# Altium project ADA_SYSTEM_TFG.PrjPcb
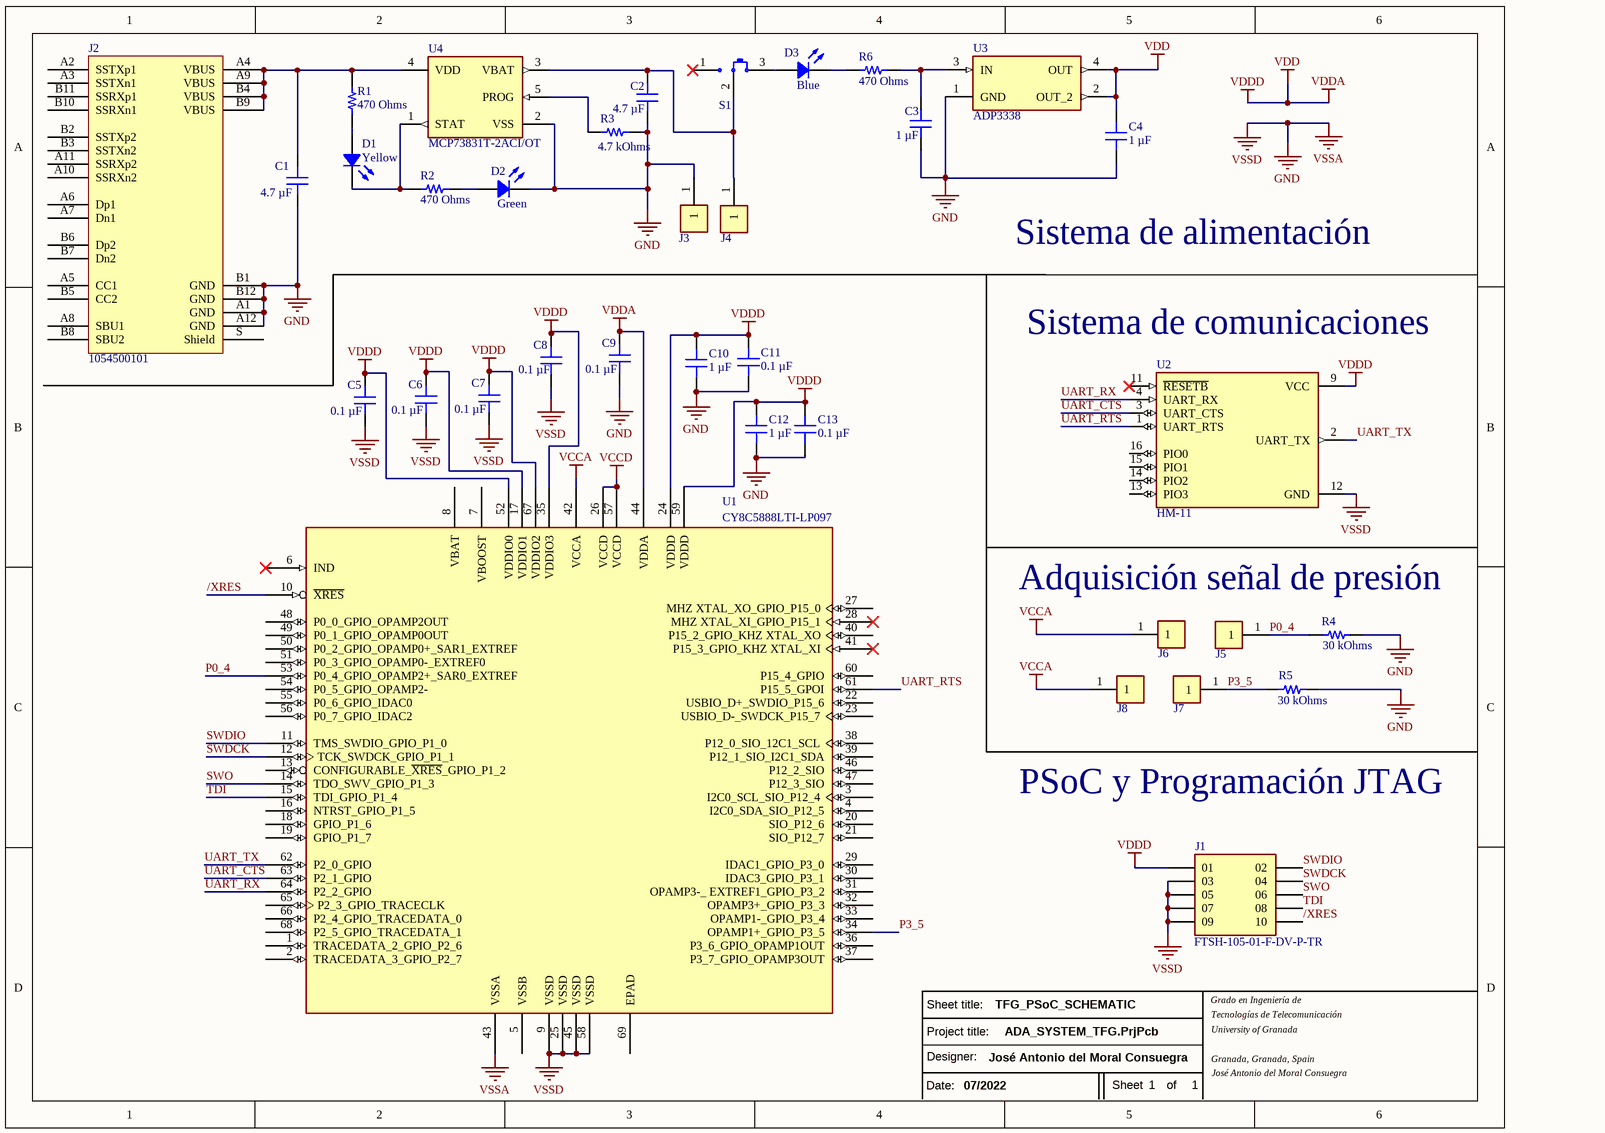
[diagram p0: TFG_PSoC_SCHEMATIC.SchDoc]
1 sheet, 35 parts. Net scope: global (net labels, ports and power ports of the same name join across sheets).
Board file: TFG_PSoC_PCB.PcbDoc

## Sheet TFG_PSoC_SCHEMATIC.SchDoc
size 282 x 211 mm; SheetNumber: 1; SheetTotal: 1

### Parts
C1  4.7 µF  [CAP 0805_2012]
C2  4.7 µF  [CAP 0805_2012]
C3  1 µF  [CAP 0603_1608]
C4  1 µF  [CAP 0603_1608]
C5  0.1 µF  [CAP 0603_1608]
C6  0.1 µF  [CAP 0603_1608]
C7  0.1 µF  [CAP 0603_1608]
C8  0.1 µF  [CAP 0603_1608]
C9  0.1 µF  [CAP 0603_1608]
C10  1 µF  [CAP 0603_1608]
C11  0.1 µF  [CAP 0603_1608]
C12  1 µF  [CAP 0603_1608]
C13  0.1 µF  [CAP 0603_1608]
D1  Yellow  [LED 1206_3216 YELLOW]
D2  Green  [LED 1206_3216 GREEN]
D3  Blue  [LED 1206_3216 BLUE]
J1  FTSH-105-01-F-DV-P-TR  [SAMTEC_FTSH-105-01-F-DV-P-TR]
J2  1054500101  [Molex 1054500101]
J3  103321-1  [TE_103321-1]  (value not drawn)
J4  103321-1  [TE_103321-1]  (value not drawn)
J5  103321-1  [TE_103321-1]  (value not drawn)
J6  103321-1  [TE_103321-1]  (value not drawn)
J7  103321-1  [TE_103321-1]  (value not drawn)
J8  103321-1  [TE_103321-1]  (value not drawn)
R1  470 Ohms  [RES 0603_1608]
R2  470 Ohms  [RES 0603_1608]
R3  4.7 kOhms  [RES 0603_1608]
R4  30 kOhms  [RES 0603_1608]
R5  30 kOhms  [RES 0603_1608]
R6  470 Ohms  [RES 0603_1608]
S1  SS312SAH4-R  [NKK SS312SAH4]  (value not drawn)
U1  CY8C5888LTI-LP097  [QFN-68]
U2  HM-11  [XCVR_317030001]
U3  ADP3338  [SOT230P700X180-4N]
U4  MCP73831T-2ACI/OT  [SOT95P280X145-5N]

### Nets
GND: C1.1 C2.2 C3.1 C4.1 C5.1 C6.1 C7.1 C8.1 C9.1 C10.1 C11.1 C12.1 C13.1 D2.2 J1.03 J1.05 J1.07 J1.09 J2.A1(GND) J2.A12(GND) J2.B1(GND) J2.B12(GND) J3.1 R3.2 R4.1 R5.1 U1.9(VSSD) U1.25(VSSD) U1.43(VSSA) U1.45(VSSD) U1.58(VSSD) U2.12(GND) U3.1(GND) U4.2(VSS)  [also labelled VSSA, VSSD]
VCCA: J6.1 J8.1 U1.42(VCCA)
VCCD: U1.26(VCCD) U1.57(VCCD)
VDD: C4.2 C5.2 C6.2 C7.2 C8.2 C9.2 C10.2 C11.2 C12.2 C13.2 J1.01 U1.17(VDDIO1) U1.24(VDDD) U1.35(VDDIO3) U1.44(VDDA) U1.52(VDDIO0) U1.59(VDDD) U1.67(VDDIO2) U2.9(VCC) U3.2(OUT_2) U3.4(OUT)  [also labelled VDDA, VDDD]
/XRES: J1.10 U1.10(~{XRES})
P0_4: J5.1 R4.2 U1.53(P0_4_GPIO_OPAMP2+_SAR0_EXTREF)
P3_5: J7.1 R5.2 U1.34(OPAMP1+_GPIO_P3_5)
SWDCK: J1.04 U1.12(TCK_SWDCK_GPIO_P1_1)
SWDIO: J1.02 U1.11(TMS_SWDIO_GPIO_P1_0)
SWO: J1.06 U1.14(TDO_SWV_GPIO_P1_3)
TDI: J1.08 U1.15(TDI_GPIO_P1_4)
UART_CTS: U1.63(P2_1_GPIO) U2.3(UART_CTS)
UART_RTS: U1.61(P15_5_GPOI) U2.1(UART_RTS)
UART_RX: U1.64(P2_2_GPIO) U2.4(UART_RX)
UART_TX: U1.62(P2_0_GPIO) U2.2(UART_TX)
NetC1_2: C1.2 J2.A4(VBUS) J2.A9(VBUS) J2.B4(VBUS) J2.B9(VBUS) R1.2 U4.4(VDD)
NetC2_1: C2.1 J4.1 S1.2(COM) U4.3(VBAT)
NetC3_2: C3.2 R6.1 U3.3(IN)
NetD1_1: D1.1 R1.1
NetD1_2: D1.2 R2.2 U4.1(STAT)
NetD2_1: D2.1 R2.1
NetD3_1: D3.1 S1.3
NetD3_2: D3.2 R6.2
NetR3_1: R3.1 U4.5(PROG)

Not connected (* = marked no-connect by the designer): J2 A2(SSTXp1) A3(SSTXn1) A5(CC1) A6(Dp1) A7(Dn1) A8(SBU1) A10(SSRXn2) A11(SSRXp2) B2(SSTXp2) B3(SSTXn2) B5(CC2) B6(Dp2) B7(Dn2) B8(SBU2) B10(SSRXn1) B11(SSRXp1) S(Shield); S1 1*; U1 1(TRACEDATA_2_GPIO_P2_6) 2(TRACEDATA_3_GPIO_P2_7) 3(I2C0_SCL_SIO_P12_4) 4(I2C0_SDA_SIO_P12_5) 5(VSSB) 6(IND)* 7(VBOOST) 8(VBAT) 13(CONFIGURABLE_~{XRES}_GPIO_P1_2) 16(NTRST_GPIO_P1_5) 18(GPIO_P1_6) 19(GPIO_P1_7) 20(SIO_P12_6) 21(SIO_P12_7) 22(USBIO_D+_SWDIO_P15_6) 23(USBIO_D-_SWDCK_P15_7) 27(MHZ_XTAL_XO_GPIO_P15_0) 28(MHZ_XTAL_XI_GPIO_P15_1)* 29(IDAC1_GPIO_P3_0) 30(IDAC3_GPIO_P3_1) 31(OPAMP3-__EXTREF1_GPIO_P3_2) 32(OPAMP3+_GPIO_P3_3) 33(OPAMP1-_GPIO_P3_4) 36(P3_6_GPIO_OPAMP1OUT) 37(P3_7_GPIO_OPAMP3OUT) 38(P12_0_SIO_12C1_SCL) 39(P12_1_SIO_I2C1_SDA) 40(P15_2_GPIO_KHZ_XTAL_XO) 41(P15_3_GPIO_KHZ_XTAL_XI)* 46(P12_2_SIO) 47(P12_3_SIO) 48(P0_0_GPIO_OPAMP2OUT) 49(P0_1_GPIO_OPAMP0OUT) 50(P0_2_GPIO_OPAMP0+_SAR1_EXTREF) 51(P0_3_GPIO_OPAMP0-_EXTREF0) 54(P0_5_GPIO_OPAMP2-) 55(P0_6_GPIO_IDAC0) 56(P0_7_GPIO_IDAC2) 60(P15_4_GPIO) 65(P2_3_GPIO_TRACECLK) 66(P2_4_GPIO_TRACEDATA_0) 68(P2_5_GPIO_TRACEDATA_1) 69(EPAD); U2 11(~{RESETB})* 13(PIO3) 14(PIO2) 15(PIO1) 16(PIO0)

### Notes on the sheet
- Sistema de alimentación
- (near U2) Sistema de comunicaciones
- Adquisición señal de presión
- PSoC y Programación JTAG
- Sheet title:
- TFG_PSoC_SCHEMATIC
- Grado en Ingeniería de
- Tecnologías de Telecomunicación
- Date:
- Project title:
- Designer:
- 07/2022
- José Antonio del Moral Consuegra
- Sheet
- 1
- of
- University of Granada
- Granada, Granada, Spain

### Library data of the parts
C1 C2 = CL21B475KOFNFNE: CAP CER 4.7UF 16V X7R 0805; manufacturer: Samsung Electro-Mechanics; Tolerance: ±10%; Part Number: CL21B475KOFNFNE; Value: 4.7 µF; Applications: General Purpose; Capacitance: 4.7 µF; componentlink1description: Datasheet; componentlink1url: http://www.samsungsem.com/kr/support/product-search/mlcc/CL21B475KOFNFNE.jsp; componentlink2description: DigiKey Link; componentlink2url: https://www.digikey.com/en/products/detail/samsung-electro-mechanics/CL21B475KOFNFNE/3888628; Device Package: 0805 (2012 Metric); lastupdated: 27/06/2022 11:05:52; Lifecycle Status: Active; Minimum Order: 1; Mounting Type: Surface Mount, MLCC; Operating Temperature: -55°C ~ 125°C; Package / Case: 0805 (2012 Metric); packaging: TapeAndReel; partid: 4760; Part Status: Active; price: 0.03; series: CL; Size / Dimension: 0.079" L x 0.049" W (2.00mm x 1.25mm); Supplier 1: DigiKey; Supplier Part Number 1: 1276-2970-1-ND; Temperature Coefficient: X7R; Thickness (Max): 0.053" (1.35mm); Voltage - Rated: 16V
C3 C4 C10 C12 = C0603X105M4RACAUTO: CAP CER 1UF 16V X7R 0603; manufacturer: KEMET; Tolerance: ±20%; Part Number: C0603X105M4RACAUTO; Value: 1 µF; Applications: Automotive, Boardflex Sensitive; Capacitance: 1 µF; componentlink1description: Datasheet; componentlink1url: https://api.kemet.com/component-edge/download/datasheet/C0603X105M4RACAUTO.pdf; componentlink2description: DigiKey Link; componentlink2url: https://www.digikey.com/en/products/detail/kemet/C0603X105M4RACAUTO/8635846; Device Package: 0603 (1608 Metric); Features: Soft Termination; lastupdated: 27/06/2022 11:02:50; Lifecycle Status: Active; Minimum Order: 1; Mounting Type: Surface Mount, MLCC; Operating Temperature: -55°C ~ 125°C; Package / Case: 0603 (1608 Metric); packaging: CutTape; partid: 3927; Part Status: Active; price: 0.09; Ratings: AEC-Q200; series: SMD Auto X7R Flex; Size / Dimension: 0.063" L x 0.031" W (1.60mm x 0.80mm); Supplier 1: DigiKey; Supplier Part Number 1: 399-17719-2-ND; Temperature Coefficient: X7R; Thickness (Max): 0.037" (0.95mm); Voltage - Rated: 16V
C5-C9 C11 C13 = CS0603KRX7R7BB104: CAP CER 0.1UF 16V X7R 0603; manufacturer: Yageo; Tolerance: ±10%; Part Number: CS0603KRX7R7BB104; Value: 0.1 µF; Applications: Boardflex Sensitive; Capacitance: 0.1 µF; componentlink1description: Datasheet; componentlink1url: http://www.yageo.com/NewPortal/yageodocoutput?fileName=/pdf/MLCC/UPY-ST_NPOX7R_16V-to-3KV_5.pdf; componentlink2description: DigiKey Link; componentlink2url: https://www.digikey.com/en/products/detail/yageo/CS0603KRX7R7BB104/6097897; Device Package: 0603 (1608 Metric); Features: Soft Termination; lastupdated: 27/06/2022 11:02:54; Lifecycle Status: Active; Minimum Order: 1; Mounting Type: Surface Mount, MLCC; Operating Temperature: -55°C ~ 125°C; Package / Case: 0603 (1608 Metric); packaging: TapeAndReel; partid: 2286; Part Status: Active; price: 0.02; series: CS; Size / Dimension: 0.063" L x 0.031" W (1.60mm x 0.80mm); Supplier 1: DigiKey; Supplier Part Number 1: 311-3560-1-ND; Temperature Coefficient: X7R; Thickness (Max): 0.037" (0.95mm); Voltage - Rated: 16V
D1 = 5990240007F: LED YELLOW 1206 SMD; Manufacturer: Dialight; Configuration: Standard; Current - Test: 20mA; Lens Color: 0.80mm; Lens Size: 2.00mm x 1.60mm; Lens Style: Rectangle with Flat Top; Millicandela Rating: 126mcd; Viewing Angle: 140°; Voltage - Forward (Vf) (Typ): 2.1V; Wavelength - Dominant: 590nm; Part Number: 5990240007F; Color: Yellow; ComponentLink1Description: Datasheet; ComponentLink1URL: http://www.dialightsignalsandcomponents.com/Assets/Brochures_And_Catalogs/Indication/CBI_SMD_new/Dialight_CBI_data_599-1206_Apr2018.pdf; ComponentLink2Description: DigiKey Link; ComponentLink2URL: https://www.digikey.com/en/products/detail/dialight/5990240007F/9385418; Device Package: 1206 (3216 Metric); Height (Max): 0.80mm; LastUpdated: 27/06/2022 11:49:43; Lifecycle Status: Active; Minimum Order: 1; Mounting Type: Surface Mount; Package / Case: 1206 (3216 Metric); Packaging: TapeAndReel; PartId: 1; Part Status: Active; Price: 0.04; Series: 599; Size / Dimension: 3.20mm L x 1.60mm W; Supplier 1: DigiKey; Supplier Part Number 1: 350-4363-1-ND; Supplier Device Package: 1206; Value: Yellow
D2 = SM1206GC-IL: LED GREEN CLEAR 1206 SMD; Manufacturer: Bivar Inc.; Configuration: Standard; Current - Test: 20mA; Lens Color: Colorless; Lens Size: 1.10mm Dia; Lens Style: Round with Flat Top; Millicandela Rating: 40mcd; Viewing Angle: 30°; Voltage - Forward (Vf) (Typ): 2V; Wavelength - Dominant: 570nm; Wavelength - Peak: 568nm; Part Number: SM1206GC-IL; Color: Green; ComponentLink1Description: Datasheet; ComponentLink1URL: https://www.bivar.com/Files/Datasheets/SM1206GC-IL.pdf; ComponentLink2Description: DigiKey Link; ComponentLink2URL: https://www.digikey.com/en/products/detail/bivar-inc/SM1206GC-IL/3095544; Device Package: 1206 (3216 Metric); Height (Max): 1.40mm; LastUpdated: 27/06/2022 11:49:06; Lens Transparency: Clear; Lifecycle Status: Active; Minimum Order: 1; Mounting Type: Surface Mount; Package / Case: 1206 (3216 Metric); Packaging: TapeAndReel; PartId: 536; Part Status: Active; Price: 0.24; Series: -; Size / Dimension: 3.20mm L x 1.60mm W; Supplier 1: DigiKey; Supplier Part Number 1: 492-1697-1-ND; Supplier Device Package: 1206; Value: Green
D3 = 5990291007F: LED BLUE 1206 SMD; Part Number: 5990291007F
J1 = FTSH-105-01-F-DV-P-TR: MF: Samtec; Package: None; Price: None; Value: *; MP: FTSH-105-01-F-DV-P-TR; Availability: Unavailable
J2 = 1054500101: CONN RCP USB3.1 TYPEC 24P SMD RA; Manufacturer: Molex; Connector Type: USB - C (Type - C); Current Rating (Amps): 0.25A, 1A, 5A; Gender: Receptacle; Mating Cycles: 10000; Number of Contacts: 24; Number of Ports: 1; Shielding: Shielded; Specifications: USB 3.1 (USB 3.1 Gen 2, Superspeed+); Voltage - Rated: 30VAC/DC; Part Number: 1054500101; ComponentLink1Description: Datasheet; ComponentLink1URL: https://www.molex.com/pdm_docs/ps/PS-105448-001.pdf; ComponentLink2Description: DigiKey Link; ComponentLink2URL: http://digikey.com/product-detail/en/molex/1054500101/WM12856CT-ND/5843891; LastUpdated: 06/06/2020 2:14:04; Lifecycle Status: Active; Minimum Order: 1; Mounting Feature: Horizontal; Mounting Type: Surface Mount, Right Angle; Through Hole; Operating Temperature: -30°C ~ 85°C; Packaging: TapeAndReel; Part Status: Active; Price: 1.22; Series: 105445; Supplier 1: DigiKey; Supplier Part Number 1: WM12856CT-ND; Termination: Solder
J3-J8 = 103321-1: Pin 01 MODII HDR SRST B/A .100CL 1 POS; MF: TE Connectivity; Package: None; Value: *; Availability: Bad; MP: 103321-1; Check_prices: https://www.snapeda.com/parts/103321-1/TE%20Connectivity/view-part/4238470/?ref=eda; SnapEDA_Link: https://www.snapeda.com/parts/103321-1/TE%20Connectivity/view-part/4238470/?ref=snap; Price: None
R1 R2 R6 = RN73R1JTTD2200B25: RES 220 OHM 0.1% 1/10W 0603; Manufacturer: KOA Speer Electronics, Inc.; Power (Watts): 0.1W, 1/10W; Resistance: 220 Ohms; Temperature Coefficient: ±25ppm/°C; Part Number: RN73R1JTTD2200B25; Value: 470 Ohms; ComponentLink1Description: Datasheet; ComponentLink1URL: //media.digikey.com/pdf/Data%20Sheets/KOA%20Speer/RN73R_Type_DS.pdf; ComponentLink2Description: DigiKey Link; ComponentLink2URL: http://digikey.com/product-detail/en/koa-speer-electronics-inc/RN73R1JTTD2200B25/2019-RN73R1JTTD2200B25CT-ND/9991980; Composition: Metal Film; Device Package: 0603 (1608 Metric); Features: Moisture Resistant; Height - Seated (Max): 0.022" (0.55mm); LastUpdated: 27/06/2022 11:23:46; Lifecycle Status: Active; Minimum Order: 1; Number of Terminations: 2; Operating Temperature: -55°C ~ 155°C; Package / Case: 0603 (1608 Metric); Packaging: TapeAndReel; PartId: 8403; Part Status: Active; Price: 0.06; Series: RN73R; Size / Dimension: 0.063" L x 0.031" W (1.60mm x 0.80mm); Supplier 1: DigiKey; Supplier Part Number 1: 2019-RN73R1JTTD2200B25CT-ND; Supplier Device Package: 0603; Tolerance: ±0.1%
R3 = CR0603-FX-2002ELF: RES SMD 20K OHM 1% 1/10W 0603; Manufacturer: Bourns Inc.; Power (Watts): 0.1W, 1/10W; Resistance: 20 kOhms; Temperature Coefficient: ±100ppm/°C; Part Number: CR0603-FX-2002ELF; Value: 4.7 kOhms; ComponentLink1Description: Datasheet; ComponentLink1URL: https://www.bourns.com/docs/Product-Datasheets/CHPREZTR.pdf; ComponentLink2Description: DigiKey Link; ComponentLink2URL: https://www.digikey.com/en/products/detail/bourns-inc/CR0603-FX-2002ELF/3740911; Composition: Thick Film; Device Package: 0603 (1608 Metric); Features: Moisture Resistant; Height - Seated (Max): 0.022" (0.55mm); LastUpdated: 27/06/2022 11:22:32; Lifecycle Status: Active; Minimum Order: 1; Number of Terminations: 2; Operating Temperature: -55°C ~ 155°C; Package / Case: 0603 (1608 Metric); Packaging: CutTape; PartId: 25447; Part Status: Active; Price: 0.01; Series: CR0603; Size / Dimension: 0.063" L x 0.031" W (1.60mm x 0.80mm); Supplier 1: DigiKey; Supplier Part Number 1: CR0603-FX-2002ELFCT-ND; Supplier Device Package: 0603; Tolerance: ±1%
R4 R5 = ERA-3AEB303V: RES SMD 30K OHM 0.1% 1/10W 0603; Manufacturer: Panasonic Electronic Components; Power (Watts): 0.1W, 1/10W; Temperature Coefficient: ±25ppm/°C; Part Number: ERA-3AEB303V; Value: 30 kOhms; ComponentLink1Description: Datasheet; ComponentLink1URL: https://industrial.panasonic.com/cdbs/www-data/pdf/RDM0000/AOA0000C307.pdf; ComponentLink2Description: DigiKey Link; ComponentLink2URL: https://www.digikey.com/en/products/detail/panasonic-electronic-components/ERA-3AEB303V/1465889; Composition: Thin Film; Device Package: 0603 (1608 Metric); Features: Automotive AEC-Q200; Height - Seated (Max): 0.022" (0.55mm); LastUpdated: 27/06/2022 11:23:56; Lifecycle Status: Active; Minimum Order: 1; Number of Terminations: 2; Operating Temperature: -55°C ~ 155°C; Package / Case: 0603 (1608 Metric); Packaging: TapeAndReel; PartId: 5528; Part Status: Active; Price: 0.04; Ratings: AEC-Q200; Resistance: 30 kOhms; Series: ERA-3A; Size / Dimension: 0.063" L x 0.031" W (1.60mm x 0.80mm); Supplier 1: DigiKey; Supplier Part Number 1: P30KDBCT-ND; Supplier Device Package: 0603; Tolerance: ±0.1%
S1 = SS312SAH4-R: SWITCH SLIDE SPDT 0.4VA 28V; Manufacturer: NKK Switches; Actuator Length: 2.00mm; Actuator Type: Standard; Contact Timing: Shorting (MBB); Current Rating (Amps): 0.4VA (AC/DC); Switch Function: On-On; Part Number: SS312SAH4-R; Circuit: SPDT; ComponentLink1Description: Datasheet; ComponentLink1URL: http://www.nkkswitches.com/pdf/SS3surfaceMount-1.pdf; ComponentLink2Description: DigiKey Link; ComponentLink2URL: http://digikey.com/product-detail/en/nkk-switches/SS312SAH4-R/360-2924-1-ND/1051215; Contact Finish: Gold; Contact Material: Phosphor Bronze; LastUpdated: 04/01/2020 19:10:14; Lifecycle Status: Active; Minimum Order: 1; Mounting Type: Surface Mount, Right Angle; Operating Temperature: -25°C ~ 85°C; Packaging: TapeAndReel; PartId: 1; Part Status: Active; Price: 1.95; Series: SS3; Supplier 1: DigiKey; Supplier Part Number 1: 360-2924-1-ND; Termination Style: Gull Wing; Voltage Rating - AC: 28V; Voltage Rating - DC: 28V
U1 = CY8C5888LTI-LP097: Manufacturer Name: CYPRESS; Part Number: CY8C5868LTI-LP036
U2 = 317030001: Bluetooth Bluetooth v4.0 Transceiver Module 2.4GHz Integrated, Trace Surface Mount; MF: Seeed Technology; Value: *; SnapEDA_Link: https://www.snapeda.com/parts/317030001/Seeed%20Technology%20Co.%2C%20Ltd/view-part/449174/?ref=snap; Digi-Key_Purchase_URL: https://www.digikey.kr/product-detail/en/seeed-technology-co-ltd/317030001/1597-1359-ND/5487659?utm_source=snapeda&utm_medium=aggregator&utm_campaign=symbol; MP: 317030001; Digi-Key_Part_Number: 1597-1359-ND; Package: Module Seeed Technology
U3 = ADP3338AKCZ-3.3-RL: Linear Voltage Regulator IC Positive Fixed 1 Output 1A SOT-223-3; MF: Analog Devices; MP: ADP3338AKCZ-3.3-RL; Package: SOT-223-3 Analog Devices; Digi-Key_Part_Number: ADP3338AKCZ-3.3-RLCT-ND; Check_prices: https://www.snapeda.com/parts/ADP3338AKCZ-3.3-RL/Analog%20Devices%20Inc./view-part/1133809/?ref=eda; Value: *; SnapEDA_Link: https://www.snapeda.com/parts/ADP3338AKCZ-3.3-RL/Analog%20Devices%20Inc./view-part/1133809/?ref=snap; Purchase-URL: https://pricing.snapeda.com/search/part/ADP3338AKCZ-3.3-RL/?ref=eda
U4 = MCP73831T-4ADI/OT: Charger IC Lithium Ion/Polymer SOT-23-5; MF: Microchip; MP: MCP73831T-4ADI/OT; Value: *; SnapEDA_Link: https://www.snapeda.com/parts/MCP73831T-4ADI/OT/Microchip/view-part/1037576/?ref=snap; Package: SOT-23-5 Microchip; Availability: Unavailable; Price: None